# EAGLE design e18_cc2652p (EAGLE 9.6.2)
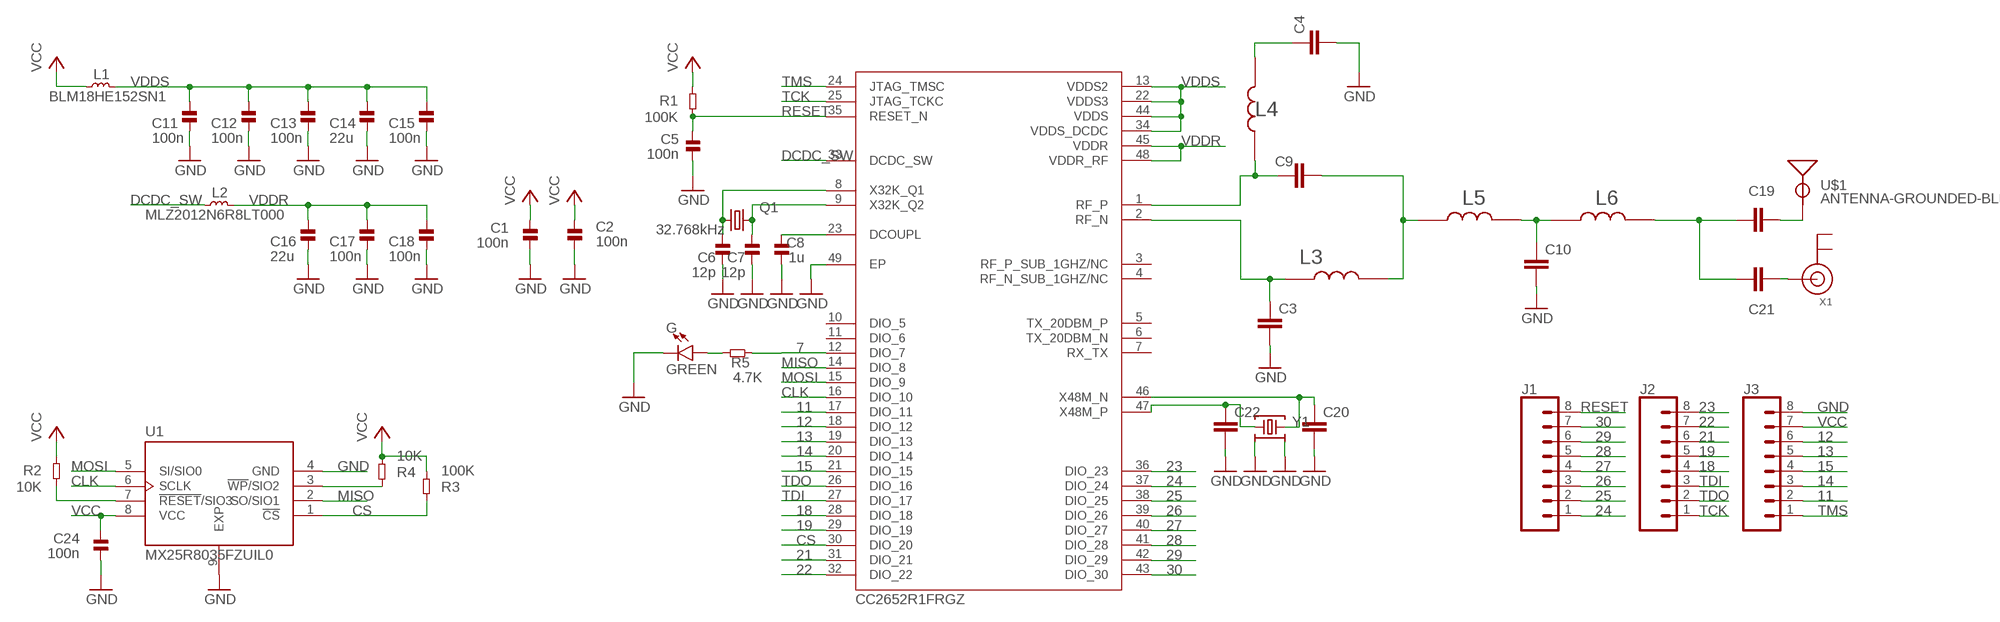
[diagram p0: schematic, sheet 1]

## Parts
C1  100n  CAP-0402  [_PKG_C_0402]
C2  100n  CAP-0402  [_PKG_C_0402]
C3  1pf  CAP0402  [CAPC1005X40N]
C4  12pf  CAP0402  [CAPC1005X40N]
C5  100n  CAP-0402  [_PKG_C_0402]
C6  12p  CAP-0402  [_PKG_C_0402]
C7  12p  CAP-0402  [_PKG_C_0402]
C8  1u  CAP-0402  [_PKG_C_0402]
C9  1pf  CAP0402  [CAPC1005X40N]
C10  1pf  CAP0402  [CAPC1005X40N]
C11  100n  CAP-0402  [_PKG_C_0402]
C12  100n  CAP-0402  [_PKG_C_0402]
C13  100n  CAP-0402  [_PKG_C_0402]
C14  22u  CAP-0805  [_PKG_C_0805]
C15  100n  CAP-0402  [_PKG_C_0402]
C16  22u  CAP-0805  [_PKG_C_0805]
C17  100n  CAP-0402  [_PKG_C_0402]
C18  100n  CAP-0402  [_PKG_C_0402]
C19  2.2pf  CAP0402  [CAPC1005X40N]
C20  6.8pf  CAP0402  [CAPC1005X40N]
C21  2.2pf  CAP0402  [CAPC1005X40N]
C22  6.8pf  CAP0402  [CAPC1005X40N]
C24  100n  CAP-0402  [_PKG_C_0402]
G  GREEN  LED-GREEN0603  [LED-0603]
IC3  CC2652R1FRGZ  CC2652P1FRGZRRGZ0048A-MFG  [RGZ0048A-MFG]
J1  CONN_111X8-1.27MM  [1X11-1.27MM]
J2  CONN_111X8-1.27MM  [1X11-1.27MM]
J3  CONN_111X8-1.27MM  [1X11-1.27MM]
L1  BLM18HE152SN1  INDUCTOR-0603  [_PKG_L_0603]
L2  MLZ2012N6R8LT000  INDUCTOR-0805  [_PKG_C_0805]
L3  2.4uH  IND0402IND0402  [INDC1005X40N]
L4  2.4uH  IND0402IND0402  [INDC1005X40N]
L5  2uH  IND0402IND0402  [INDC1005X40N]
L6  2uH  IND0402IND0402  [INDC1005X40N]
Q1  32.768kHz  KX-327-RT  [2.0X1.2]
R1  100K  RES-0402  [_PKG_C_0402]
R2  10K  RES-0402  [_PKG_C_0402]
R3  100K  RES-0402  [_PKG_C_0402]
R4  10K  RES-0402  [_PKG_C_0402]
R5  4.7K  RES-0402  [_PKG_C_0402]
U1  MX25R8035FZUIL0  [PSON50P200X300X60-9N]
U$1  ANTENNA-GROUNDED-BLE  [TRACE_ANTENNA_2.4GHZ_BLE]
X1  ANTENNA_U.FL  [U.FL]
Y1  Q22FA12800150  48.000MHZ_CX2016DB48000C0FPLC1  [XTAL-4P-2016]

## Nets
7: IC3.12(DIO_7) R5.1
11: IC3.17(DIO_11) J3.2
12: IC3.18(DIO_12) J3.6
13: IC3.19(DIO_13) J3.5
14: IC3.20(DIO_14) J3.3
15: IC3.21(DIO_15) J3.4
18: IC3.28(DIO_18) J2.4
19: IC3.29(DIO_19) J2.5
21: IC3.31(DIO_21) J2.6
22: IC3.32(DIO_22) J2.7
23: IC3.36(DIO_23) J2.8
24: IC3.37(DIO_24) J1.1
25: IC3.38(DIO_25) J1.2
26: IC3.39(DIO_26) J1.3
27: IC3.40(DIO_27) J1.4
28: IC3.41(DIO_28) J1.5
29: IC3.42(DIO_29) J1.6
30: IC3.43(DIO_30) J1.7
CLK: IC3.16(DIO_10) U1.6(SCLK)
CS: IC3.30(DIO_20) R3.2 U1.1(!CS)
DCDC_SW: IC3.33(DCDC_SW) L2.1
GND: C1.1 C2.1 C3.2 C4.2 C5.1 C6.1 C7.1 C8.1 C10.2 C11.2 C12.2 C13.2 C14.2 C15.2 C16.2 C17.2 C18.2 C20.2 C22.2 C24.1 G.C IC3.49(EP) J3.8 U1.4(GND) U1.9(EXP) Y1.2 Y1.4
MISO: IC3.14(DIO_8) U1.2(SO/SIO1)
MOSI: IC3.15(DIO_9) U1.5(SI/SIO0)
N$1: C9.1 IC3.1(RF_P) L4.1
N$2: C3.1 IC3.2(RF_N) L3.1
N$3: C4.1 L4.2
N$4: C9.2 L3.2 L5.1
N$5: C19.1 C21.1 L6.2
N$6: C21.2 X1.3(SIGNAL)
N$7: C19.2 U$1.P$1(SIGNAL) U$1.P$2(SIGNAL) U$1.P$3(SIGNAL) U$1.P$4(SIGNAL) U$1.P$5(SIGNAL) U$1.P$6(SIGNAL) U$1.P$7(SIGNAL) U$1.P$8(SIGNAL) U$1.P$9(SIGNAL) U$1.P$10(SIGNAL) U$1.P$11(SIGNAL) U$1.P$12(SIGNAL) U$1.P$13(SIGNAL) U$1.P$14(SIGNAL) U$1.P$15(SIGNAL) U$1.P$16(SIGNAL) U$1.P$17(SIGNAL) U$1.P$18(SIGNAL) U$1.SIGNAL
N$9: C8.2 IC3.23(DCOUPL)
N$10: C10.1 L5.2 L6.1
N$11: R2.1 U1.7(!RESET!/SIO3)
N$12: C20.1 IC3.46(X48M_N) Y1.3
N$13: R4.2 U1.3(!WP!/SIO2)
N$14: G.A R5.2
N$15: C22.1 IC3.47(X48M_P) Y1.1
RESET: C5.2 IC3.35(RESET_N) J1.8 R1.1
TCK: IC3.25(JTAG_TCKC) J2.1
TDI: IC3.27(DIO_17) J2.3
TDO: IC3.26(DIO_16) J2.2
TMS: IC3.24(JTAG_TMSC) J3.1
VCC: C1.2 C2.2 C24.2 J3.7 L1.1 R1.2 R2.2 R3.1 R4.1 U1.8(VCC)
VDDR: C16.1 C17.1 C18.1 IC3.45(VDDR) IC3.48(VDDR_RF) L2.2
VDDS: C11.1 C12.1 C13.1 C14.1 C15.1 IC3.13(VDDS2) IC3.22(VDDS3) IC3.34(VDDS_DCDC) IC3.44(VDDS) L1.2
X32K_Q1: C6.2 IC3.8(X32K_Q1) Q1.1
X32K_Q2: C7.2 IC3.9(X32K_Q2) Q1.2
Unconnected: IC3.3(RF_P_SUB_1GHZ/NC) IC3.4(RF_N_SUB_1GHZ/NC) IC3.5(TX_20DBM_P) IC3.6(TX_20DBM_N) IC3.7(RX_TX) IC3.10(DIO_5) IC3.11(DIO_6) X1.1(GND) X1.2(GND)

## Library data of the parts
C1 C2 C5-C8 C11-C18 C24 = ok-discretes-dev:CAP
C3 C4 C9 C10 C19-C22 = discretes-dev:CAP0402: CAP, 0402; AVAILABILITY: Good; DESCRIPTION: RESISTOR, 0402 0.063W 1% 3M6; Resistance:3.6Mohm; Resistance Tolerance:± 1%; Power Rating:0.063W; Voltage Rating:50V; Series:RC32H; Temperature Coefficient:± 100ppm/°C; Resistor Element Type:Thick Film; Resistor Case Style:0402; No. of Pins:2; SVHC:No SVHC; Case Style:0402; External Length / Height:1mm; Temperature Coeff. +:100ppm/°C; Temperature Coeff. -:100ppm/°C; External Depth:0.35mm; External Width:0.5mm; Operating Temperature Range:-55°C to +155°C; Overload Voltage:100V; MF: Yageo; MP: RC0402FR-073M6L; PACKAGE: 1005 Panasonic Electronic Components; PRICE: None; PURCHASE-URL: https://pricing.snapeda.com/search/part/RC0402FR-073M6L/?ref=eda
G = SparkFun-LED:LED-GREEN: Green SMD LED Used in manufacturing of various products at SparkFun Packages: 0603 - SMD 0603 package [Product Link] <http://www.futureelectronics.com/en/technologies/semiconductors/optoelectronics/leds/Pages/9894312-LTST-C190GKT.aspx?CrossPart=HSMG-C190&IM=0> LilyPad 1206 - SMD1206 LilyPad package [Product Link] <http://www.futureelectronics.com/en/Technologies/Product.aspx?ProductID=IN150NGHARVATEKCORPORATION2049943&IM=0> 1206 - SMD1206 package [Product Link] <http://www.futureelectronics.com/en/technologies/semiconductors/optoelectronics/leds/Pages/8315665-LTST-C150KGKT.aspx?IM=0> 1206 Bottom Mount -SMD 1206 Bottom Mount [Product Link] <http://www.digikey.com/product-detail/en/lite-on-inc/LTST-C230KGKT/160-1456-1-ND/386854> SparkFun Products: Pro Mini 328 -5V <https://www.sparkfun.com/products/821> RedBoard <https://www.sparkfun.com/products/12757> MP3 Trigger <https://www.sparkfun.com/products/13720> Makey Makey <https://www.sparkfun.com/products/11076>; PROD_ID: DIO-00821
IC3 = CC2652P1FRGZR:CC2652P1FRGZR; COPYRIGHT: Copyright (C) 2022 Ultra Librarian. All rights reserved.; MANUFACTURER_PART_NUMBER: CC2652P1FRGZR; MFR_NAME: Texas Instruments; REFDES: RefDes; TYPE: TYPE
J1-J3 = SparkFun-Connectors:CONN_11: Multi connection point. Often used as Generic Header-pin footprint for 0.1 inch spaced/style header connections On any of the 0.1 inch spaced packages, you can populate with these: Break Away Headers - Straight <https://www.sparkfun.com/products/116> (PRT-00116) Break Away Male Headers - Right Angle <https://www.sparkfun.com/products/553> (PRT-00553) Female Headers <https://www.sparkfun.com/products/115> (PRT-00115) Break Away Headers - Machine Pin <https://www.sparkfun.com/products/117> (PRT-00117) Break Away Female Headers - Swiss Machine Pin <https://www.sparkfun.com/products/743> (PRT-00743) For SCREWTERMINALS and SPRING TERMINALS visit here: Screw Terimnals on SparkFun.com <https://www.sparkfun.com/search/results?term=Screw+Terminals> (5mm/3.5mm/2.54mm spacing) This device is also useful as a general connection point to wire up your design to another part of your project. Our various solder wires solder well into these plated through hole pads. Hook-Up Wire - Assortment (Stranded, 22 AWG) <https://www.sparkfun.com/products/11375> (PRT-11375) Hook-Up Wire - Assortment (Solid Core, 22 AWG) <https://www.sparkfun.com/products/11367> (PRT-11367) View the entire wire category on our website here <https://www.sparkfun.com/categories/141>
L1 L2 = ok-discretes-dev:INDUCTOR
L3-L6 = discretes-dev:IND0402: RESISTOR, 0402 0.063W 1% 3M6; Resistance:3.6Mohm; Resistance Tolerance:± 1%; Power Rating:0.063W; Voltage Rating:50V; Series:RC32H; Temperature Coefficient:± 100ppm/°C; Resistor Element Type:Thick Film; Resistor Case Style:0402; No. of Pins:2; SVHC:No SVHC; Case Style:0402; External Length / Height:1mm; Temperature Coeff. +:100ppm/°C; Temperature Coeff. -:100ppm/°C; External Depth:0.35mm; External Width:0.5mm; Operating Temperature Range:-55°C to +155°C; Overload Voltage:100V Check prices <https://pricing.snapeda.com/parts/RC0402FR-073M6L/Yageo/view-part?ref=eda>; AVAILABILITY: Good; DESCRIPTION: RESISTOR, 0402 0.063W 1% 3M6; Resistance:3.6Mohm; Resistance Tolerance:± 1%; Power Rating:0.063W; Voltage Rating:50V; Series:RC32H; Temperature Coefficient:± 100ppm/°C; Resistor Element Type:Thick Film; Resistor Case Style:0402; No. of Pins:2; SVHC:No SVHC; Case Style:0402; External Length / Height:1mm; Temperature Coeff. +:100ppm/°C; Temperature Coeff. -:100ppm/°C; External Depth:0.35mm; External Width:0.5mm; Operating Temperature Range:-55°C to +155°C; Overload Voltage:100V; MF: Yageo; MP: RC0402FR-073M6L; PACKAGE: 1005 Panasonic Electronic Components; PRICE: None; PURCHASE-URL: https://pricing.snapeda.com/search/part/RC0402FR-073M6L/?ref=eda
Q1 = crystal-geyer_V1_0:KX-327: Tuning Fork Crystals (kHz) SMD: KX327 - Serie Model Size l/w/h [mm] Frequency Range Frequency Stability Temp. Range [°C] Load Capacitance AECQ 200 availabel Datasheet KX-327VT KX-327FT KX-327RT KX-327NHT KX-327NHF KX-327L KX-327S 1.25/1.05/0.5 1.6/1.0/0.5 2.0/1.2/0.6 3.2/1.5/0.8 3.2/1.5/0.8 7.0/1.5/1.4 8.2/3.8/2.5 32,768 kHz 32,768 kHz 32,768 kHz 32,768 kHz 32,768 kHz 32,768 kHz 32,768 kHz ±10 … ±20ppm ±10 … ±20ppm ±10 … ±20ppm ±10 … ±20ppm ±10 … ±20ppm ±10 … ±20ppm ±5 … ±20ppm (*) -40°C …+85°C (*) -40°C …+85°C (*) -40°C …+85°C (*) -40°C …+85°C (*) -40°C …+125°C (*) -40°C …+85°C (*) -40°C …+85°C 7/9/12,5 7/9/12,5 7/9/12,6 7/9/12,5 9/12,5 7/9/12,5 6/12,5 - - - - yes - - KX-327VT.pdf <http://www.geyer-electronic.de/uploads/tx_userartikelfrequenz/GEYER-KX-327VT.pdf> KX-327FT.pdf <http://www.geyer-electronic.de/uploads/tx_userartikelfrequenz/GEYER-KX-327FT.pdf> KX-327RT.pdf <http://www.geyer-electronic.de/uploads/tx_userartikelfrequenz/GEYER-KX-327RT.pdf> KX-327NHT.pdf <http://www.geyer-electronic.de/uploads/tx_userartikelfrequenz/GEYER-KX-327NHT.pdf> KX-327NHF.pdf <http://www.geyer-electronic.de/uploads/tx_userartikelfrequenz/GEYER-KX-327NHF.pdf> KX-327L.pdf <http://www.geyer-electronic.de/uploads/tx_userartikelfrequenz/GEYER-KX-327L.pdf> KX-327S.pdf <http://www.geyer-electronic.de/uploads/tx_userartikelfrequenz/GEYER-KX-327S.pdf> <http://www.geyer-electronic.de/fileadmin/template/img/logo-geyer-electronic.png> Details see: http://www.geyer-electronic.de/Frequenz-Produkte.9.0.html Created 2016-06-07, Hans Locher 2016 (C) Geyer Quartz Technology KX327VT,KX327FT,KX327RT,KX327NHT,KX327NHF,KX327S,KX327L;125105;1610;2012;3215;7015;8238;1,25x1,05,1.25x1.05;1,6x1,0,1.6x1.0;2,0x1,2,2.0x1.2;3,2x1,5,3.2x1.5;8,2x3,8,8.2x3.8,7.0x1.5,7,0x1,532.768kHz
R1-R5 = ok-discretes-dev:RES
U1 = MX25R8035FZUIL0:MX25R8035FZUIL0: FLASH - NOR Memory IC 8Mb (1M x 8) SPI - Quad I/O 33 MHz 8-USON (2x3) Check availability <https://pricing.snapeda.com/parts/MX25R8035FZUIL0/Macronix/view-part?ref=eda>; AVAILABILITY: In Stock; DESCRIPTION: NOR Flash Serial 1.8V/3.3V 8M-bit 8M/4M/2M x 1/2-bit/4-bit 12ns 8-Pin USON EP; MF: Macronix; MP: MX25R8035FZUIL0; PACKAGE: None; PRICE: None; PURCHASE-URL: https://pricing.snapeda.com/search/part/MX25R8035FZUIL0/?ref=eda
U$1 = SparkFun-RF2:ANTENNA-GROUNDED-BLE
X1 = adafruit:ANTENNA_U.FL: U.FL Antenna Connector
Y1 = ok-xtal-osc-dev:48.000MHZ_CX2016DB48000C0FPLC1: 48MHz ±10ppm Crystal 7pF 50 Ohms 4-SMD, No Lead Datasheet <https://media.digikey.com/pdf/Data%20Sheets/Kyocera%20International/CX2016DB48000C0FPLC1_DS.pdf>; DIGIKEY_PART: 1253-2042-1-ND; MFG_NAME: KYOCERA; MFG_PART: CX2016DB48000C0FPLC1

## Board
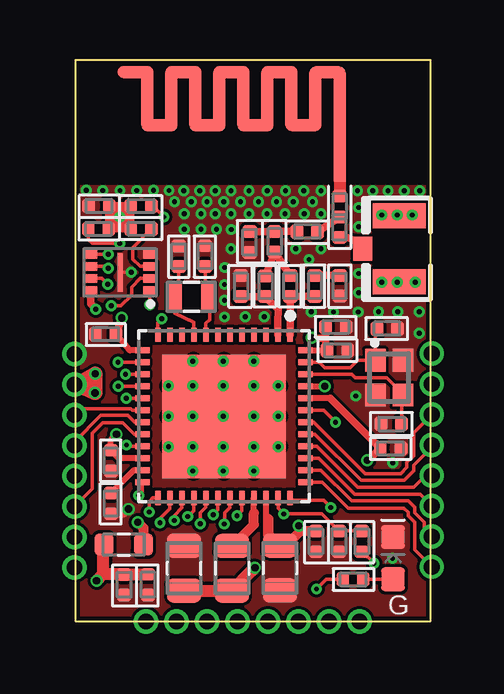
[diagram p1: board, top side]
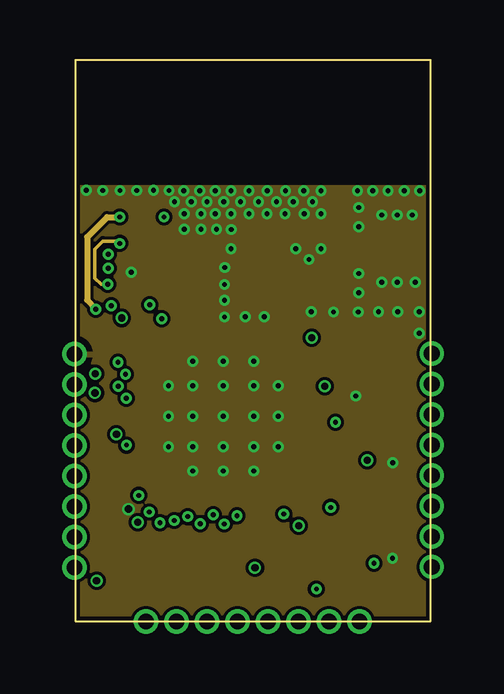
[diagram p2: board, inner layer Route2]
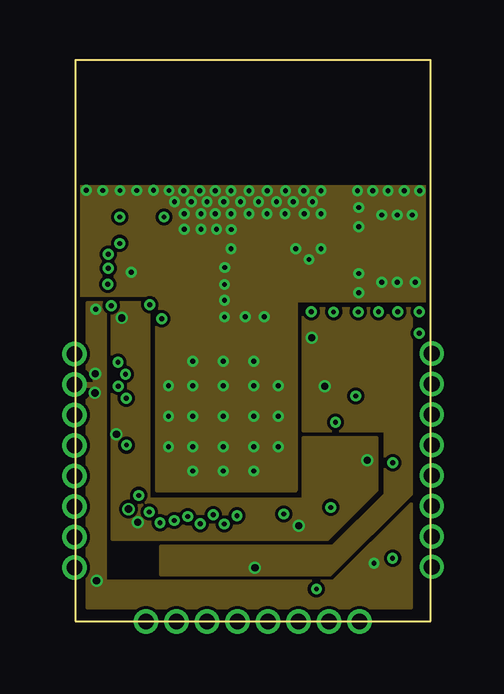
[diagram p3: board, inner layer Route15]
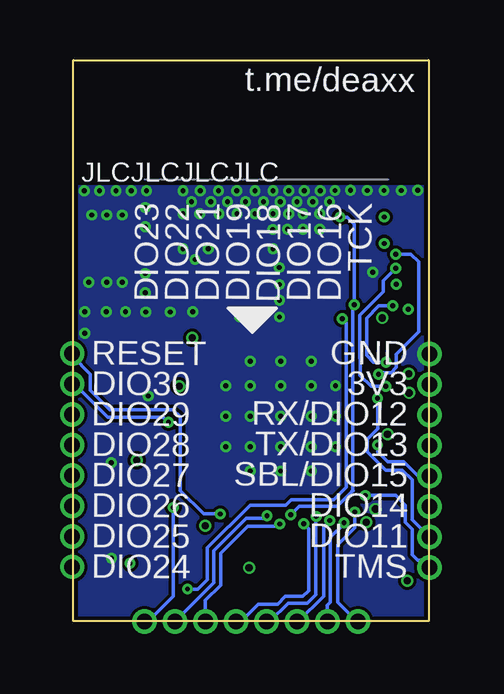
[diagram p4: board, bottom side, seen from below]

Size 14.8 x 23.38 mm. Coordinates in mm from the lower left corner, seen from the top.
Outline: 14.8,0 14.8,23.38 0,23.38 0,0 14.8,0
Copper layers (1*2*15*16): Top 0.035559375mm / dielectric 0.17018125mm / Route2 0.01778125mm / dielectric 0.4mm / Route15 0.01778125mm / dielectric 0.17018125mm / Bottom 0.035559375mm
Design rules "oshpark-4layer *": minimum track width 6mil, minimum drill 0.2mm, track to track 5mil, track to pad 5mil, pad to pad 5mil, via to via 5mil, smd to smd 5mil, copper to edge 0.16mm, drill to drill 0.2mm, minimum pad ring 4mil, minimum via ring 4mil, stop-mask expansion 0.05841875mm, vias tented up to drill 50mil, thermal gap 10mil
tRestrict: area 4.4,13 to 5.2,14.1; 2 lines

### Footprints (pad centres in the part's own frame; a part is rotated, then mirrored left to right if it is on the bottom)
_PKG_C_0402 = smd 0.54 x 0.6: 1 -0.43,0; 2 0.43,0
CAPC1005X40N = smd 0.54 x 0.6: 1 -0.432,0; 2 0.432,0
_PKG_C_0805 = smd 1 x 1.42: 1 -0.935,0; 2 0.935,0
LED-0603 = smd 1 x 1: A -0.877,0; C 0.877,0
RGZ0048A-MFG = smd 0.6 x 0.24: 1 -3.4,2.75; 2 -3.4,2.25; 3 -3.4,1.75; 4 -3.4,1.25; 5 -3.4,0.75; 6 -3.4,0.25; 7 -3.4,-0.25; 8 -3.4,-0.75; 9 -3.4,-1.25; 10 -3.4,-1.75; 11 -3.4,-2.25; 12 -3.4,-2.75; 25 3.4,-2.75; 26 3.4,-2.25; 27 3.4,-1.75; 28 3.4,-1.25; 29 3.4,-0.75; 30 3.4,-0.25; 31 3.4,0.25; 32 3.4,0.75; 33 3.4,1.25; 34 3.4,1.75; 35 3.4,2.25; 36 3.4,2.75 | smd 0.24 x 0.6: 13 -2.75,-3.4; 14 -2.25,-3.4; 15 -1.75,-3.4; 16 -1.25,-3.4; 17 -0.75,-3.4; 18 -0.25,-3.4; 19 0.25,-3.4; 20 0.75,-3.4; 21 1.25,-3.4; 22 1.75,-3.4; 23 2.25,-3.4; 24 2.75,-3.4; 37 2.75,3.4; 38 2.25,3.4; 39 1.75,3.4; 40 1.25,3.4; 41 0.75,3.4; 42 0.25,3.4; 43 -0.25,3.4; 44 -0.75,3.4; 45 -1.25,3.4; 46 -1.75,3.4; 47 -2.25,3.4; 48 -2.75,3.4 | smd 5.15 x 5.15: 49 0,0 | smd 0.5 x 0.5: 50 1.26,-2.325; 51 0,-2.325; 52 -1.26,-2.325; 53 1.26,2.325; 54 0,2.325; 55 -1.26,2.325; 56 2.325,-1.26; 57 2.325,0; 58 2.325,1.26; 59 -2.325,-1.26; 60 -2.325,0; 61 -2.325,1.26; 62 0,-1.26; 63 0.025,0; 64 0,1.26; 65 1.26,-1.26; 66 1.26,0; 67 1.26,1.26; 68 -1.26,-1.26; 69 -1.26,0; 70 -1.26,1.26
1X11-1.27MM = drill 0.65 pad 1.016: 1 0,0; 2 1.27,0; 3 2.54,0; 4 3.81,0; 5 5.08,0; 6 6.35,0; 7 7.62,0; 8 8.89,0
_PKG_L_0603 = smd 0.79 x 0.93: 1 -0.82,0; 2 0.82,0
INDC1005X40N = smd 0.54 x 0.6: 1 -0.432,0; 2 0.432,0
2.0X1.2 = smd 0.6 x 1.1: 1 -0.7,0; 2 0.7,0
PSON50P200X300X60-9N = smd 0.56 x 0.35: 1 -1.235,0.75; 2 -1.235,0.25; 3 -1.235,-0.25; 4 -1.235,-0.75; 5 1.235,-0.75; 6 1.235,-0.25; 7 1.235,0.25; 8 1.235,0.75 | smd 0.2 x 1.6: 9 0,0
TRACE_ANTENNA_2.4GHZ_BLE = smd 1.5 x 0.5: P$1 -2.493,4.578; P$2 -3.493,2.368; P$3 -4.483,4.578; P$4 -8.493,4.578; P$5 -1.483,2.371; P$6 -5.493,2.368; P$7 -0.49,4.574; P$8 -6.493,4.578; P$9 -7.493,2.368 | smd 0.5 x 2.7: P$10 -0.989,3.473; P$11 -1.989,3.473; P$12 -2.989,3.473; P$13 -3.989,3.473; P$14 -4.989,3.473; P$15 -5.989,3.473; P$16 -6.989,3.473; P$17 -7.989,3.473 | smd 0.5 x 4.8: P$18 0.018,2.414 | smd 0.5 x 0.5: SIGNAL 0.018,0.255
U.FL = smd 2.2 x 1.05: 1 0,1.375; 2 0,-1.375 | smd 0.8 x 1: 3 1.525,0
XTAL-4P-2016 = smd 0.95 x 0.85: 1 -0.725,-0.575; 2 0.725,-0.575; 3 0.725,0.575; 4 -0.725,0.575

### Placement (x,y rotation side)
C1  2.03,1.51 90 top
C2  3.02,1.52 90 top
C3  6.89,13.96 90 top
C4  11.01,13.97 270 top
C5  10.98,3.32 90 top
C6  5.4,15.21 269.9 top
C7  4.3,15.2 270 top
C8  1.49,4.91 90 top
C9  8.95,13.96 90 top
C10  7.25,15.79 270 top
C11  1.26,11.95 180 top
C12  1.48,6.68 270 top
C13  13.13,7.19 0 top
C14  8.52,2.21 270 top
C15  10.02,3.32 270 top
C16  4.52,2.2 90 top
C17  10.91,11.28 0 top
C18  10.85,12.25 0 top
C19  11,17.27 90 top
C20  13.16,8.22 180 top
C21  11,16.41 270 top
C22  12.99,12.18 0 top
C24  0.98,17.3 0 top
G  13.23,2.62 90 top
IC3  6.19,8.53 270 top
J1  14.85,2.26 90 top
J2  2.94,-0.02 0 top
J3  -0.03,2.24 90 top
L1  2.01,3.19 0 top
L2  6.53,2.2 270 top
L3  7.91,13.95 90 top
L4  9.97,13.96 90 top
L5  8.29,15.81 90 top
L6  9.66,16.23 0 top
Q1  4.83,13.51 180 top
R1  11.93,3.32 270 top
R2  0.96,16.34 0 top
R3  2.74,17.3 0 top
R4  2.74,16.34 0 top
R5  11.57,1.74 0 top
U1  1.86,14.53 180 top
U$1  10.99,18.29 0 top
X1  13.49,15.52 180 top
Y1  13.07,10.14 270 top

### Tracks (layer width: path | path; a pad name or v marks a point on that pad's centre or on a via)
7  (via drill 0.2 pad 0.45)
  Top 0.152: IC3.12 3.44,12.44 v3.6,12.6 | R5.1 10.45,1.74 v10.04,1.33
  Bottom 0.152: v3.6,12.6 v3.59,12.6 3.43,12.43 3.43,5.57 3.94,5.06 5.72,5.06 5.95,4.83 7.44,4.83 9.22,3.05 9.22,1.72 9.61,1.33 v10.04,1.33
11  (via drill 0.2 pad 0.45)
  Top 0.152: IC3.17 v2.12,9.28
  Bottom 0.152: v2.12,9.28 2.12,8.01 2.55,7.58 2.55,7.05 1.79,6.28 1.09,6.28 0.69,5.88 0.69,4.23 J3.2
12
  Top 0.152: IC3.18 2.36,8.78 2.3,8.85 0.23,8.85 J3.6
13
  Top 0.152: IC3.19 2.47,8.28 2.18,8.57 1.06,8.57 -0.03,7.47 J3.5
14
  Top 0.152: IC3.20 2.44,7.78 1.97,8.26 1.14,8.26 0.7,7.82 0.7,5.51 J3.3
15  (via drill 0.2 pad 0.45)
  Top 0.152: IC3.21 2.18,7.28 v2.12,7.33
  Bottom 0.152: v2.12,7.33 2.12,7.06 1.69,6.63 1.03,6.63 0.45,6.05 J3.4
18  (via drill 0.2 pad 0.45)
  Top 0.152: IC3.28 4.94,4.61 v4.68,4.35
  Bottom 0.152: v4.68,4.35 4.7,4.34 4.7,1.1 5.05,0.75 5.85,0.75 6.61,-0.02 J2.4
19  (via drill 0.2 pad 0.45)
  Top 0.152: IC3.29 5.44,4.74 5.2,4.5 v5.2,4.05 | v5.2,4.05
  Bottom 0.152: 7.78,-0.02 J2.5 7.81,-0.02 7.09,0.7 6.29,0.7 5.97,1.03 5.24,1.03 5,1.27 5,3.85 v5.2,4.05
21  (via drill 0.2 pad 0.45)
  Top 0.152: IC3.31 6.44,4.73 6.21,4.51 6.21,4.05 v6.2,4.04
  Bottom 0.152: v6.2,4.04 6.29,3.95 7.53,3.95 8.66,2.82 8.66,1.49 9.29,0.86 J2.6
22  (via drill 0.2 pad 0.45)
  Top 0.152: IC3.32 6.94,4.59 v6.73,4.39
  Bottom 0.152: v6.73,4.39 v6.74,4.39 6.84,4.28 7.59,4.28 8.94,2.93 8.94,1.61 J2.7
23  (via drill 0.2 pad 0.45)
  Top 0.152: v10.64,4.73 10.34,5.03 9.03,5.03 IC3.36
  Bottom 0.152: v10.64,4.73 10.64,1.03 11.68,-0.02 J2.8
24
  Top 0.152: IC3.37 10.28,5.78 11.36,4.71 13.69,4.71 13.86,4.53 13.86,4.39 14.14,4.11 14.14,2.97 J1.1
25
  Top 0.152: 14.84,3.53 J1.2 14.52,3.85 14.52,4.12 14.14,4.51 14.14,4.73 13.86,5.01 13.61,5.01 13.61,5 11.51,5 10.23,6.28 IC3.38
26
  Top 0.152: IC3.39 10.14,6.78 11.64,5.29 14.36,5.29 J1.3
27
  Top 0.152: J1.4 14.6,6.07 14.1,5.58 11.76,5.58 10.05,7.28 IC3.40
28
  Top 0.152: J1.5 14.85,7.25 14.09,6.49 14.09,6.25 13.69,5.86 11.9,5.86 9.98,7.78 IC3.41
29
  Top 0.152: J1.6 | IC3.42 9.94,8.28 12.07,6.15 13.55,6.15 13.81,6.4 13.81,6.61 14.09,6.9 14.09,7.85 14.52,8.29 | 14.52,8.29 14.51,8.3 | J1.6 14.52,8.29
30  (via drill 0.2 pad 0.45)
  Top 0.152: IC3.43 10.34,8.78 v10.84,8.28
  Bottom 0.152: v10.84,8.28 11.05,8.5 13.37,8.5 14.52,9.65 14.62,9.65 J1.7
CLK  (via drill 0.2 pad 0.45)
  Top 0.152: IC3.16 v1.79,9.78 | U1.6 1.28,14.78 v1.36,14.7
  Bottom 0.152: v1.79,9.78 2.39,9.78 2.84,10.23 | 2.86,10.25 2.84,10.23 | 2.84,10.23 2.84,10.94 2.86,10.96 2.86,12.74 1.89,13.71 1.89,14.17 v1.36,14.7
CS  (via drill 0.2 pad 0.45)
  Top 0.152: IC3.30 5.94,4.63 v5.74,4.43 | R3.2 3.23,17.3 v3.69,16.83 | U1.1 v3.1,13.19 v3.09,13.18
  Bottom 0.152: 3.14,5.43 3.19,5.38 | 3.19,5.38 3.79,4.78 5.39,4.78 v5.74,4.43 | 3.19,5.38 3.19,5.42 3.15,5.46 3.15,13.13 v3.09,13.18 3.09,16.53 3.39,16.83 v3.69,16.83
DCDC_SW
  Top 0.254: 7.44,4.49 IC3.33
  Top 0.406: 6.5,3.16 L2.1 | L2.1 6.4,3.26 | 6.56,3.13 L2.1 | 6.82,3.22 6.73,3.13 L2.1 | 7.44,4.49 7.44,4.02 6.55,3.13 L2.1 | L2.1 6.6,3.13
GND  (via drill 0.2 pad 0.45, 0.3)
  Top 0.152: Y1.2 12.49,9.33 | IC3.49 v4.9,8.53 v4.89,8.53 | U1.9 1.87,14.53 v2.32,14.53
  Top 0.254: C17.2 | C18.2 11.28,12.29 | C8.1 1.58,4.48
  Top 0.305: C8.1 2.02,4.48 v2.21,4.67
  other vias: 14.34,17.93 13.71,17.93 13.02,17.93 12.39,17.93 11.75,17.93 10.23,17.93 9.51,17.93 8.75,17.93 7.99,17.93 7.23,17.93 13.4,14.12 12.77,14.12 14.16,14.12 13.4,16.92 12.77,16.92 14.04,16.92 8.45,7.26 8.45,8.53 8.45,9.8 7.43,9.8 7.43,10.82 6.16,10.82 4.89,10.82 3.88,9.8 3.88,8.53 3.88,7.26 4.89,7.26 4.89,9.8 4.89,6.25 6.16,6.25 7.43,6.25 6.16,7.26 6.16,8.53 6.16,9.8 7.43,8.53 7.43,7.26 6.21,13.37 6.21,14.03 6.22,14.73 6.48,15.52 7.86,12.68 7.07,12.68 10.76,12.88 11.78,12.88 14.33,12.89 11.68,9.38 14.33,11.99 12.63,12.89 13.43,12.89 13.22,6.59 9.83,12.89 6.49,16.32 6.48,17.93 5.83,17.93 5.18,17.93 4.52,17.93 3.89,17.94 5.23,16.97 4.53,16.97 4.53,16.33 5.23,16.33 6.21,12.67 13.21,2.62 0.44,17.96 1.14,17.94 1.86,17.94 2.55,17.94 3.25,17.95 11.8,17.23 11.8,16.43 11.8,14.48 11.8,13.68 5.88,16.33 5.83,16.97 6.48,16.97 7.23,16.97 7.98,16.97 8.73,16.97 9.53,16.97 10.23,16.97 4.83,17.47 5.48,17.47 6.18,17.47 6.88,17.47 4.13,17.47 7.63,17.47 8.38,17.47 9.08,17.47 9.88,17.47 10.23,15.52 9.18,15.52 9.73,15.07
  pour Route15: 3.39,5.44 9.17,5.44 9.21,5.47 9.21,13.35 14.96,13.35 14.96,18.09 -0.07,18.09 -0.07,13.57 3.39,13.57
  pour Route2: -0.07,18.09 -0.07,0.02 14.98,0.02 14.98,18.09
  pour Top (no thermals): -0.07,0.01 15.07,0.01 15.07,18.1 -0.07,18.1
  pour Bottom (no thermals): -0.09,0.02 15.06,0.02 15.06,18.09 -0.09,18.09
MISO  (via drill 0.2 pad 0.45)
  Top 0.152: IC3.14 v1.78,10.78 v1.77,10.79 | 3,14.18 U1.2 2.7,14.28 2.34,13.92 2.34,13.58 1.89,13.13 v1.49,13.13 1.44,13.13
  Bottom 0.152: v1.77,10.79 2.29,10.79 2.58,11.08 2.58,12.63 2.07,13.13 v1.49,13.13
MOSI  (via drill 0.2 pad 0.45)
  Top 0.152: IC3.15 v2.09,10.28 | U1.5 1.36,15.28 v1.37,15.29
  Bottom 0.152: v2.09,10.28 2.01,10.35 1.56,10.35 1.34,10.58 1.34,11.13 0.41,12.06 0.41,14.97 0.73,15.29 v1.36,15.29 v1.37,15.29
N$1
  Top 0.305: 8.94,12.23 C9.1 L4.1 | 8.94,12.23 IC3.1 | IC3.1 8.94,12.23 | L4.1
N$2
  Top 0.305: L3.1 7.79,13.52 | 7.87,13.56 L3.1 | C3.1 6.9,13.51 L3.1 | L3.1 | IC3.2 8.44,12.44 8.44,12.99 L3.1
N$3
  Top 0.305: 9.98,14.41 L4.2 C4.1
N$4
  Top 0.305: C9.2 8.95,14.41 | 7.96,14.43 L3.2 L5.1 | C9.2 8.95,14.45 | 8.29,15.31 L5.1 | C9.2 L5.1
N$5
  Top 0.305: C21.1 | C21.1 | C21.1 10.99,16.83 L6.2
N$6
  Top 0.305: C21.2 11.35,15.98 11.65,15.84 X1.3
N$7
  Top 0.152: 6.01,20.66 6.01,21.75 U$1.P$14 6,20.67 6.01,20.66 | U$1.P$6 6.01,20.66
  Top 0.305: U$1.P$4 2.51,22.88 3.04,22.88 3.04,21.81 U$1.P$17 3,20.69 2.94,20.63 3.47,20.63 U$1.P$9 3.92,20.66 3.99,20.58 4,20.59 U$1.P$16 4,22.78 3.94,22.83 3.97,22.87 U$1.P$8 5.02,22.87 5.04,22.88 5.04,21.81 U$1.P$15 5,20.74 4.94,20.68 4.97,20.66 U$1.P$6 | U$1.P$14 6,22.68 5.94,22.73 6.07,22.87 U$1.P$3 6.52,22.88 7.04,22.88 7.04,21.81 U$1.P$13 7,20.74 6.94,20.68 6.97,20.66 U$1.P$2 8.07,20.66 8.09,20.63 8.09,21.67 U$1.P$12 8,22.78 | 8,22.78 7.94,22.83 | U$1.SIGNAL U$1.P$18 11,22.82 10.96,22.86 U$1.P$7 9.97,22.86 9.94,22.83 9.94,21.82 U$1.P$10 10.04,21.72 10.04,20.63 9.53,20.63 U$1.P$5 9.21,20.66 9,20.88 U$1.P$11 9.04,21.81 9.04,22.83 9.01,22.87 U$1.P$1 8.4,22.78 8,22.78
  Top 0.508: U$1.SIGNAL C19.2
N$9
  Top 0.254: IC3.23 2.42,6.28 1.49,5.35 C8.2
N$10
  Top 0.305: C10.1 8.28,16.22 L5.2 9.21,16.24 L6.1
N$11  (via drill 0.2 pad 0.45)
  Top 0.152: 0.53,16.45 R2.1 0.54,16.32 0.54,15.88 0.69,15.73 v1.84,15.73 | U1.7 1.1,14.28 v1.35,14.03
  Route2 0.152: v1.35,14.03 1.07,14.03 0.81,14.29 0.81,15.49 1.14,15.83 1.75,15.83 v1.84,15.73
N$12
  Top 0.152: IC3.46 11.51,10.28 11.65,10.14 12.96,10.14 13.64,9.45 Y1.3 13.59,9.36 C20.1
N$13
  Top 0.152: U1.3 2.7,14.78 2.39,15.08 2.39,15.56 R4.2
N$14
  Top 0.152: R5.2 G.A
N$15
  Top 0.152: 12.51,12.13 C22.1 12.49,12.12 Y1.1 | Y1.1 12.39,10.76 | 9.6,10.76 IC3.47 10.16,10.78 10.38,10.56 11.45,10.56 11.76,10.87 Y1.1
RESET  (via drill 0.2 pad 0.45)
  Top 0.152: C5.2 | IC3.35 8.44,4.7 v8.68,4.46 10.27,4.46 C5.2 | C5.2 R1.1
  Bottom 0.152: J1.8 14.85,11.04 14.09,10.28 14.09,9.61 13.29,8.81 10.65,8.81 10.34,8.5 10.34,5.43 9.37,4.46 v8.68,4.46
TCK  (via drill 0.2 pad 0.45)
  Top 0.152: IC3.25 3.22,5.13 3.07,4.98 v3.07,4.54
  Bottom 0.152: v3.07,4.54 3.07,3.9 3.79,3.18 3.79,0.78 2.99,-0.02 J2.1
TDI  (via drill 0.2 pad 0.45)
  Top 0.152: IC3.27 4.43,4.71 4.12,4.4 v4.12,4.19
  Bottom 0.152: J2.3 5.42,-0.02 4.37,1.04 4.37,3.94 v4.12,4.19
TDO  (via drill 0.2 pad 0.45)
  Top 0.152: IC3.26 3.94,4.67 3.52,4.26 v3.52,4.1
  Bottom 0.152: J2.2 4.21,0.65 4.09,0.78 4.09,3.5 3.52,4.06 v3.52,4.1
TMS  (via drill 0.2 pad 0.45)
  Top 0.152: IC3.24 2.79,5.38 v2.64,5.23
  Bottom 0.152: v2.64,5.23 1.36,5.23 0.96,4.83 0.96,4.11 0.68,3.82 0.68,2.77 0.44,2.53 0.26,2.53 J3.1
VCC  (via drill 0.2 pad 0.45, 0.3)
  Top 0.152: R1.2 11.96,2.89 v12.44,2.41
  Top 0.254: R1.2
  Top 0.305: v0.85,13 0.63,13.22 U1.8 | R2.2 1.84,16.34 | 1.84,16.34 R4.1 | R2.2 1.39,16.83 | 1.39,16.83 1.39,17.28 C24.2 | R4.1 2.31,16.78 | 2.31,16.78 2.31,17.25 | 1.89,17.3 R3.1 2.31,17.25 | 1.89,17.3 C24.2 | 1.39,16.83 v1.84,16.83 | v1.84,16.83 1.89,16.88 1.89,17.3 | v1.84,16.83 2.26,16.83 2.31,16.78 | v1.84,16.83 1.84,16.34 | C24.2 2.31,16.4 R4.1 | R2.2 2.31,17.25
  Top 0.508: C2.2 C1.2 1.15,1.94 | 1.15,1.94 1.14,1.94 v0.88,1.68 | 1.15,1.94 1.15,3.15 L1.1
  Top 0.61: J3.7 0.01,9.86 v0.83,10.3 0.83,9.51 v0.81,9.51 0.15,9.8 -0.02,9.84 J3.7
  Route2 0.254: v0.85,13 0.48,13.37 0.48,15.99 1.32,16.83 v1.84,16.83
  pour Route15: 0.49,13.27 1.24,13.27 1.24,1.65 10.75,1.65 13.99,4.9 13.99,0.56 0.49,0.56
VDDR  (via drill 0.3)
  Top 0.254: IC3.45 v10.38,9.78 v10.39,9.79 | IC3.48 10.41,11.28 10.42,11.26
  Top 0.305: C17.1 10.48,11.38 | C17.1 10.48,11.41 | 10.42,11.34 C18.1 10.42,11.79 9.85,11.79 v9.84,11.8 | 10.42,11.34 10.42,11.26 | 10.42,11.34 C17.1
  Top 0.508: C16.1 L2.2 7.37,2.11 v7.48,2.22
  pour Route15: 9.49,7.92 12.9,7.92 12.9,5.29 10.72,3.11 3.55,3.11 3.55,1.93 10.62,1.93 13.98,5.29 13.98,13.02 9.49,13.02
VDDS  (via drill 0.3, 0.3 pad 0.45)
  Top 0.254: IC3.22 1.81,6.78 C12.1 1.48,7.56 v1.71,7.78 | 10.62,9.28 IC3.44 | IC3.13 2.27,11.28 C11.1 | 8.02,3.63 7.94,3.7 IC3.34
  Top 0.305: 12.7,7.26 C13.1 | 1.78,11.86 C11.1 v1.93,12.63 | C13.1 10.62,9.28 | C13.1 12.21,6.7 v12.16,6.7
  Top 0.406: C15.1 9.4,3.75 | 9.4,3.75 9.36,3.75 8.75,3.14 C14.1 | 9.4,3.75 v9.3,3.98 | v2.59,4.12 2.83,3.88 L1.2 | 8.03,4.25 8.03,3.61 | C14.1 8.03,3.61 | 8.03,3.61 8.03,3.62 | 8.03,3.62 8.02,3.62 | 8.02,3.62 8.02,3.63 | C14.1 8.03,3.62 | C14.1 8.02,3.62
  pour Route15: 12.56,7.63 12.56,5.46 10.52,3.41 1.53,3.41 1.53,13.26 3.05,13.26 3.05,5.09 9.5,5.09 9.5,7.63
X32K_Q1
  Top 0.152: IC3.8 5.44,12.4 5.59,12.55 5.59,13.46 Q1.1 5.53,14.04 5.4,14.17 C6.2
X32K_Q2
  Top 0.152: C7.2 4.3,14.2 4.13,14.03 Q1.2 4.14,12.83 4.93,12.45 4.94,12.44 IC3.9

### Text on the board
tNames: G
bNames: t.me/deaxx | JLCJLCJLCJLC | TCK | DIO16 | DIO17 | DIO18 | DIO19 | DIO21 | DIO22 | DIO23 | GND | RESET | 3V3 | RX/DIO12 | DIO30 | TX/DIO13 | DIO29 | DIO28 | SBL/DIO15 | DIO14 | DIO27 | DIO11 | DIO26 | TMS | DIO25 | DIO24